# EAGLE design 5v_LP_Test_Control (EAGLE 9.2.1)
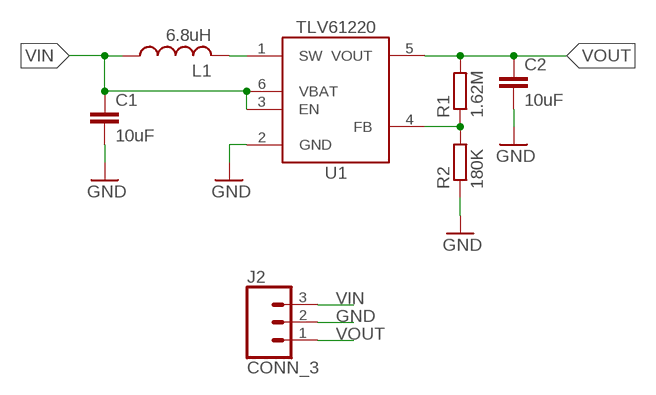
[diagram p0: schematic, sheet 1]

## Parts
C1  10uF  C-EU10UFC0805  [C0805]
C2  10uF  C-EU10UFC0805  [C0805]
J2  CONN_3  [1X03]
L1  6.8uH  INDUCTOR1008  [1008]
R1  1.62M  R-EU_R0603  [R0603]
R2  180K  R-EU_R0603  [R0603]
U1  TLV61220DBV  [DBV_R-PDSO-G6]

## Nets
GND: C1.2 C2.2 J2.2 R2.1 U1.2(GND)
N$1: R1.1 R2.2 U1.4(FB)
N$5: L1.2 U1.1(SW)
VIN: C1.1 J2.3 L1.1 U1.3(EN) U1.6(VBAT)
VOUT: C2.1 J2.1 R1.2 U1.5(VOUT)

## Library data of the parts
C1 C2 = bschulz_passives:C-EU: CAPACITOR, European symbol; DIGIKEY: 490-6473-6-ND; MF: Murata; MPN: GRM21BR61C106KE15K
J2 = bschulz:CONN_3: Genaric 3 pin header
L1 = bschulz:INDUCTOR: Genaric inductor
R1 R2 = bschulz_passives:R-EU_: RESISTOR, European symbol Digikey Parts: Yageo, 0402 <https://www.digikey.com/products/en/resistors/chip-resistor-surface-mount/52?k=&pkeyword=&sf=0&FV=ffec1104%2Cfffc000d%2C1c0002%2C440067%2C1f140000%2Cffe00034%2C400004&quantity=&ColumnSort=0&page=1&stock=1&pageSize=25> Yageo, 0603 <https://www.digikey.com/products/en/resistors/chip-resistor-surface-mount/52?k=&pkeyword=&s=4356&s=47360&sf=0&FV=fffc000d%2C1c0002%2C142c040c%2C1f140000%2Cffe00034&quantity=10&ColumnSort=1000011&page=1&stock=1&pageSize=25> Panasonic, 0603 <https://www.digikey.com/products/en/resistors/chip-resistor-surface-mount/52?k=&pkeyword=&pv252=68&sf=0&FV=ffec373d%2C1c0002%2C142c040c%2C1f140000%2Cffe00034%2C80002%2Cc0001&quantity=&ColumnSort=0&page=1&stock=1&pageSize=25> Panasonic, precision, 0603 <https://www.digikey.com/products/en/resistors/chip-resistor-surface-mount/52?FV=ffec4907%2Cfffc000a%2Cc0172%2C142c040c%2C1f140000%2Cffe00034%2C1c0002&quantity=100&ColumnSort=2085&page=1&stock=1&pageSize=25> Panasonic, 0805 <https://www.digikey.com/products/en/resistors/chip-resistor-surface-mount/52?k=&pkeyword=&pv3=1&sf=0&FV=ffec373d%2C1c0002%2C1f140000%2Cffe00034%2C142c040d&quantity=&ColumnSort=0&page=1&stock=1&pageSize=25> Rohm, current sense <https://www.digikey.com/products/en/resistors/chip-resistor-surface-mount/52?k=&pkeyword=&pv3=1&sf=0&FV=ffecb688%2C1f140000%2Cffe00034%2C1c0002&quantity=&ColumnSort=0&page=1&stock=1&pageSize=25> Vishay, pulse proof automotive <https://www.digikey.com/products/en/resistors/chip-resistor-surface-mount/52?k=&pkeyword=&pv7=2&sf=0&FV=ffec5d6b%2Cffe00034%2C1f140000&quantity=&ColumnSort=0&page=1&stock=1&pageSize=25>; MF: Yageo
U1 = bschulz:TLV61220: TLV61220 - Low-Input Voltage Step-Up Converter (Boost) Characteristics: Vin: 0.7V ~ 5.5V Vout: 1.8V ~ 5.5V Output Current (Max): 400 mA IQ: 5μA Operating Temperature: -40°C to 85°C Digikey: 296-30547-1-ND <https://www.digikey.com/product-detail/en/texas-instruments/TLV61220DBVR/296-30547-1-ND/3458120>; DIGIKEY: 296-30547-1-ND; MF: TI; MPN: TLV61220DBVR

## Board
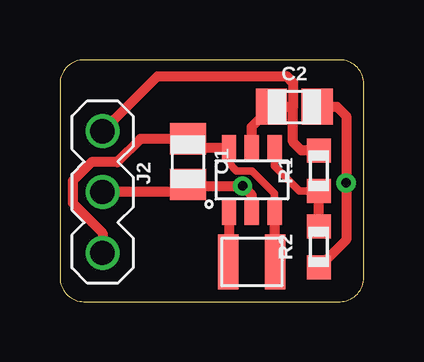
[diagram p1: board, top side]
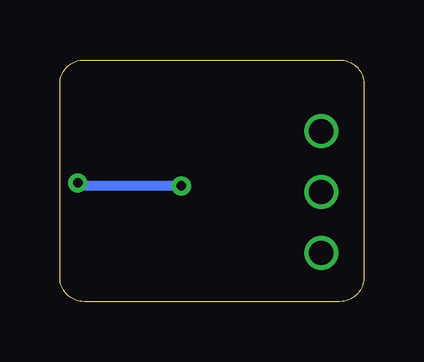
[diagram p2: board, bottom side, seen from below]

Size 12.68 x 10.08 mm. Coordinates in mm from the lower left corner, seen from the top.
Outline: 0,9.08 0,1 arc90 1,0 11.68,0 arc90 12.68,1 12.68,9.08 arc90 11.68,10.08 1,10.08 arc90 0,9.08
Copper layers (1*16): Top 0.035mm / dielectric 1.5mm / Bottom 0.035mm
Design rules "voltera-dru": minimum track width 10mil, minimum drill 0.4mm, track to track 10mil, track to pad 10mil, pad to pad 0.6mm, via to via 0.6mm, smd to smd 0mil, copper to edge 0mil, drill to drill 0.8mm, minimum pad ring 0.2mm, minimum via ring 0.2mm, stop-mask expansion 4mil, vias tented up to drill 0mil, thermal gap 10mil

### Footprints (pad centres in the part's own frame; a part is rotated, then mirrored left to right if it is on the bottom)
C0805 = smd 1.3 x 1.5: 1 -0.95,0; 2 0.95,0
1X03 = drill 1.016: 1 -2.54,0; 2 0,0; 3 2.54,0
1008 = smd 0.85 x 2.3: 1 -0.975,0; 2 0.975,0
R0603 = smd 1 x 1: 1 -0.85,0; 2 0.85,0
DBV_R-PDSO-G6 = smd 0.6 x 1.05: 1 -0.95,-1.35; 2 0,-1.35; 3 0.95,-1.35; 4 0.95,1.35; 5 0,1.35; 6 -0.95,1.35

### Placement (x,y rotation side)
C1  5.33,5.84 270 top
C2  9.78,8.13 0 top
J2  1.78,4.57 270 top
L1  8,1.65 180 top
R1  10.79,5.46 90 top
R2  10.79,2.29 90 top
U1  8,5.08 0 top

### Tracks (layer width: path | path; a pad name or v marks a point on that pad's centre or on a via)
GND  (via drill 0.4)
  Top 0.406: U1.2 8,4.45 v7.62,4.83 5.4,4.83 C1.2 5.01,4.57 J2.2 | C2.2 11.56,8.13 11.94,7.75 v11.94,4.95 11.94,2.58 R2.1
  Bottom 0.406: v7.62,4.83 11.87,4.83 v11.94,4.95
N$1
  Top 0.305: R1.1 9.99,4.61 8.95,5.65 U1.4
  Top 0.406: R2.2 R1.1
N$5
  Top 0.406: U1.1 7.05,1.68 L1.2
VIN
  Top 0.305: U1.6 7.05,5.78 7.37,5.46 8.01,5.46 8.95,4.52 U1.3
  Top 0.406: U1.6 5.7,6.43 C1.1 3.36,6.79 2.39,5.82 1.31,5.82 0.53,5.04 0.53,4.11 1.78,2.86 J2.3 | U1.3 8.95,1.68 L1.1
VOUT
  Top 0.406: U1.5 8,7.3 C2.1 9.72,8.13 | R1.2 10.07,6.31 9.72,6.66 9.72,8.13 | 9.72,8.13 9.72,9.14 9.47,9.4 4.06,9.4 J2.1